# EAGLE design pc_ads1293_brk (EAGLE 9.5.2)
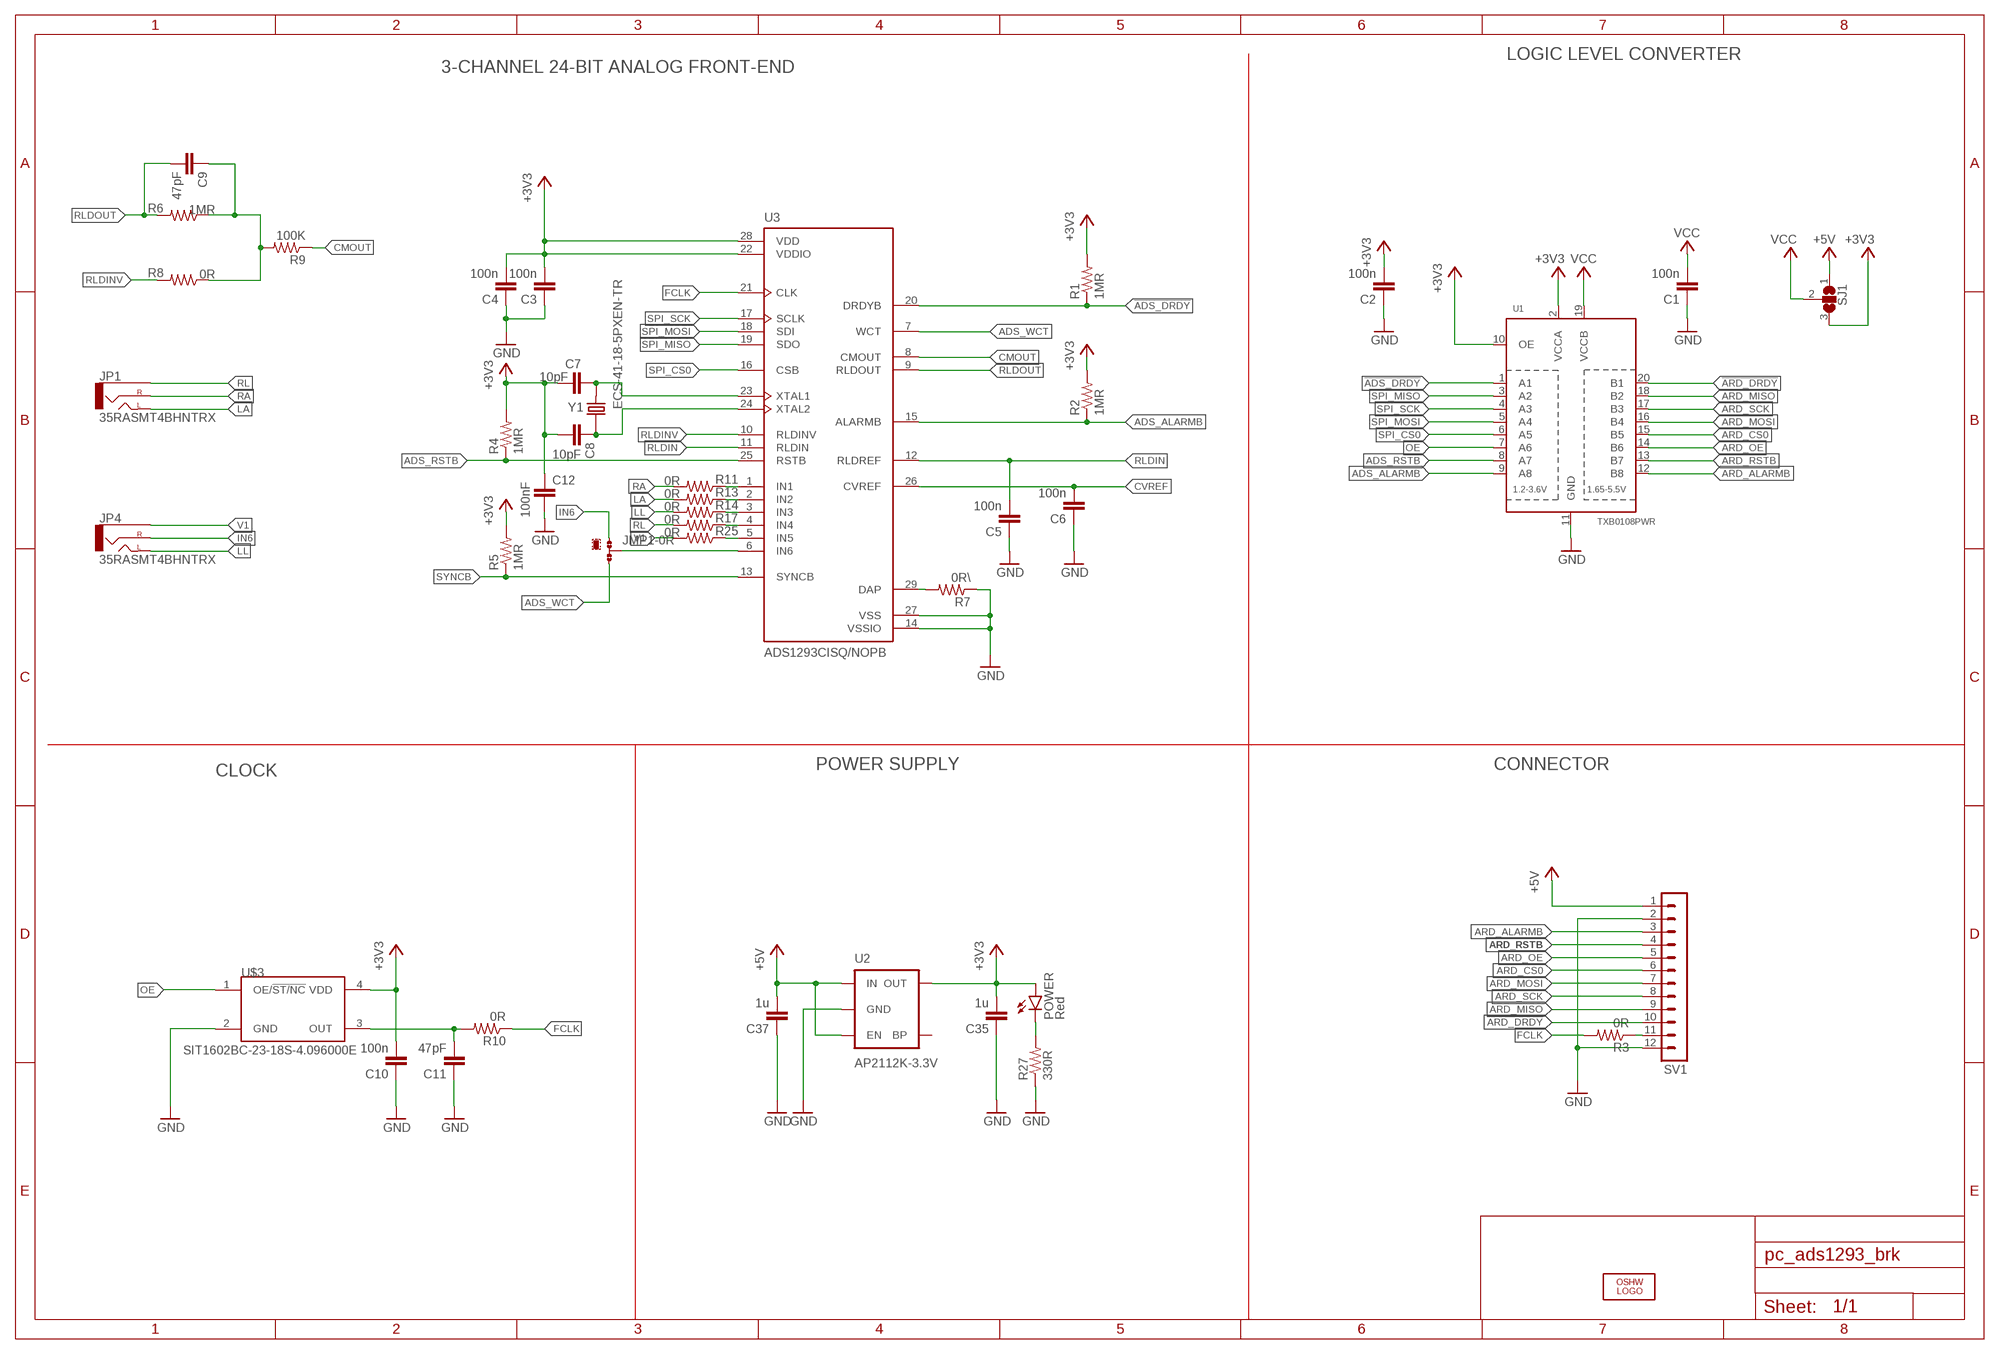
[diagram p0: schematic, sheet 1]

## Parts
C1  100n  C-EUC0402  [C0402]
C2  100n  C-EUC0402  [C0402]
C3  100n  C-EUC0402  [C0402]
C4  100n  C-EUC0402  [C0402]
C5  100n  C-EUC0402  [C0402]
C6  100n  C-EUC0402  [C0402]
C7  10pF  C-EUC0402  [C0402]
C8  10pF  C-EUC0402  [C0402]
C9  47pF  C-EUC0402  [C0402]
C10  100n  C-EUC0402  [C0402]
C11  47pF  C-EUC0402  [C0402]
C12  100nF  C-EUC0402  [C0402]
C35  1u  C-EUC0402  [C0402]
C37  1u  C-EUC0402  [C0402]
JMP1  0R-JUMPB  [B0R-JMP]
JP1  35RASMT4BHNTRX  AUDIO-JACKSMD2  [AUDIO-JACK-3.5MM-SMD]
JP4  35RASMT4BHNTRX  AUDIO-JACKSMD2  [AUDIO-JACK-3.5MM-SMD]
LOGO1  OSHW_LOGO_FILLX0100-NT  [OSHW_FILLX100_NOTEXT]
POWER  Red  LEDCHIPLED_0603  [CHIPLED_0603]
R1  1MR  R-US_R0402  [R0402]
R2  1MR  R-US_R0402  [R0402]
R3  0R  R-US_R0402  [R0402]
R4  1MR  R-US_R0402  [R0402]
R5  1MR  R-US_R0402  [R0402]
R6  1MR  R-US_R0402  [R0402]
R7  0R\  R-US_R0402  [R0402]
R8  0R  R-US_R0402  [R0402]
R9  100K  R-US_R0402  [R0402]
R10  0R  R-US_R0402  [R0402]
R11  0R  R-US_R0402  [R0402]
R13  0R  R-US_R0402  [R0402]
R14  0R  R-US_R0402  [R0402]
R17  0R  R-US_R0402  [R0402]
R25  0R  R-US_R0402  [R0402]
R27  330R  R-US_R0402  [R0402]
SJ1  SJ2W  [SJ_2]
SV1  MA12-1  [MA12-1]
U1  TXB0108PWR  [TSSOP20]
U2  AP2112K-3.3V  V_REG_LDOSMD  [SOT23-5]
U3  ADS1293CISQ/NOPB  [QFN50P500X500X80-29N]
U$3  SIT1602BC-23-18S-4.096000E  [SIT1602B]
Y1  ECS-41-18-5PXEN-TR  [XTAL_ECS-41-18-5PXEN-TR]

## Nets
!ADS_DRDY: R1.1 U1.1(A1) U3.20(DRDYB)
!ARD_DRDY: SV1.10 U1.20(B1)
+3V3: C2.2 C3.2 C4.2 C7.2 C8.2 C10.2 C12.1 C35.2 POWER.A R1.2 R2.2 R4.2 R5.2 SJ1.3 U1.2(VCCA) U1.10(OE) U2.5(OUT) U3.22(VDDIO) U3.28(VDD) U$3.4(VDD)
+5V: C37.2 SJ1.1 SV1.1 U2.1(IN) U2.3(EN)
ADS_ALARMB: R2.1 U1.9(A8) U3.15(ALARMB)
ADS_RSTB: R4.1 U1.8(A7) U3.25(RSTB)
ADS_WCT: JMP1.3 U3.7(WCT)
ARD_ALARMB: SV1.3 U1.12(B8)
ARD_CS0: SV1.6 U1.15(B5)
ARD_MISO: SV1.9 U1.18(B2)
ARD_MOSI: SV1.7 U1.16(B4)
ARD_OE: SV1.5 U1.14(B6)
ARD_RSTB: SV1.4 U1.13(B7)
ARD_SCK: SV1.8 U1.17(B3)
CLK: C11.2 R10.2 U$3.3(OUT)
CMOUT: R9.1 U3.8(CMOUT)
CVREF: C6.2 U3.26(CVREF)
FCLK: R3.2 R10.1 U3.21(CLK)
GND: C1.1 C2.1 C3.1 C4.1 C5.1 C6.1 C10.1 C11.1 C12.2 C35.1 C37.1 R7.1 R27.1 SV1.2 SV1.12 U1.11(GND) U2.2(GND) U3.14(VSSIO) U3.27(VSS) U$3.2(GND)
IN6: JMP1.1 JP4.RING(RIGHT)
LA: JP1.TIP(LEFT) R13.2
LL: JP4.TIP(LEFT) R14.2
N$1: C9.1 R6.1 R8.1 R9.2
N$2: R11.1 U3.1(IN1)
N$3: JMP1.2 U3.6(IN6)
N$4: C8.1 U3.24(XTAL2) Y1.1
N$5: C7.1 U3.23(XTAL1) Y1.2
N$6: R13.1 U3.2(IN2)
N$7: POWER.C R27.2
N$8: R7.2 U3.29(DAP)
N$9: R14.1 U3.3(IN3)
N$10: R3.1 SV1.11
N$13: R17.1 U3.4(IN4)
N$15: R25.1 U3.5(IN5)
OE: U1.7(A6) U$3.1(OE/!ST/NC)
RA: JP1.RING(RIGHT) R11.2
RL: JP1.SLEEVE R17.2
RLDIN: C5.2 U3.11(RLDIN) U3.12(RLDREF)
RLDINV: R8.2 U3.10(RLDINV)
RLDOUT: C9.2 R6.2 U3.9(RLDOUT)
SPI_CS0: U1.6(A5) U3.16(CSB)
SPI_MISO: U1.3(A2) U3.19(SDO)
SPI_MOSI: U1.5(A4) U3.18(SDI)
SPI_SCK: U1.4(A3) U3.17(SCLK)
SYNCB: R5.1 U3.13(SYNCB)
V1: JP4.SLEEVE R25.2
VCC: C1.2 SJ1.2 U1.19(VCCB)
Unconnected: U2.4(BP)

## Notes on the sheet
- LOGIC LEVEL CONVERTER
- 3-CHANNEL 24-BIT ANALOG FRONT-END
- POWER SUPPLY | CONNECTOR
- CLOCK

## Library data of the parts
C1-C12 C35 C37 = rcl:C-EU: CAPACITOR, European symbol; SPICEPREFIX: C
JMP1 = jump-0r-smd:0R-JUMP: SMD 0R 0805 Jumper
JP1 JP4 = SparkFun-Connectors:AUDIO-JACK: 3.5mm Audio Jack Simple 3.5mm common PCB mount audio jack. SKU: PRT-08032; PROD_ID: CONN-10353
LOGO1 = ohw-logo:OSHW_LOGO_FILL
POWER = led:LED: LED OSRAM: - CHIPLED LG R971, LG N971, LY N971, LG Q971, LY Q971, LO R971, LY R971 LH N974, LH R974 LS Q976, LO Q976, LY Q976 LO Q996 - Hyper CHIPLED LW Q18S LB Q993, LB Q99A, LB R99A - SideLED LS A670, LO A670, LY A670, LG A670, LP A670 LB A673, LV A673, LT A673, LW A673 LH A674 LY A675 LS A676, LA A676, LO A676, LY A676, LW A676 LS A679, LY A679, LG A679 - Hyper Micro SIDELED® LS Y876, LA Y876, LO Y876, LY Y876 LT Y87S - SmartLED LW L88C, LW L88S LB L89C, LB L89S, LG L890 LS L89K, LO L89K, LY L89K LS L896, LA L896, LO L896, LY L896 - TOPLED LS T670, LO T670, LY T670, LG T670, LP T670 LSG T670, LSP T670, LSY T670, LOP T670, LYG T670 LG T671, LOG T671, LSG T671 LB T673, LV T673, LT T673, LW T673 LH T674 LS T676, LA T676, LO T676, LY T676, LB T676, LH T676, LSB T676, LW T676 LB T67C, LV T67C, LT T67C, LS T67K, LO T67K, LY T67K, LW E67C LS E67B, LA E67B, LO E67B, LY E67B, LB E67C, LV E67C, LT E67C LW T67C LS T679, LY T679, LG T679 LS T770, LO T770, LY T770, LG T770, LP T770 LB T773, LV T773, LT T773, LW T773 LH T774 LS E675, LA E675, LY E675, LS T675 LS T776, LA T776, LO T776, LY T776, LB T776 LHGB T686 LT T68C, LB T68C - Hyper Mini TOPLED® LB M676 - Mini TOPLED Santana® LG M470 LS M47K, LO M47K, LY M47K Source: http://www.osram.convergy.de LUXEON: - LUMILED® LXK2-PW12-R00, LXK2-PW12-S00, LXK2-PW14-U00, LXK2-PW14-V00 LXK2-PM12-R00, LXK2-PM12-S00, LXK2-PM14-U00 LXK2-PE12-Q00, LXK2-PE12-R00, LXK2-PE12-S00, LXK2-PE14-T00, LXK2-PE14-U00 LXK2-PB12-K00, LXK2-PB12-L00, LXK2-PB12-M00, LXK2-PB14-N00, LXK2-PB14-P00, LXK2-PB14-Q00 LXK2-PR12-L00, LXK2-PR12-M00, LXK2-PR14-Q00, LXK2-PR14-R00 LXK2-PD12-Q00, LXK2-PD12-R00, LXK2-PD12-S00 LXK2-PH12-R00, LXK2-PH12-S00 LXK2-PL12-P00, LXK2-PL12-Q00, LXK2-PL12-R00 Source: www.luxeon.com KINGBRIGHT: KA-3528ASYC Source: www.kingbright.com
R1-R11 R13 R14 R17 R25 R27 = rcl:R-US_: RESISTOR, American symbol; SPICEPREFIX: R
SJ1 = jumper:SJ2W: SMD solder JUMPER
SV1 = con-lstb:MA12-1: PIN HEADER; OC_FARNELL: unknown; OC_NEWARK: unknown
U1 = adafruit:TXB0108PWR: 8-Bit Bi-Directional Level Shifter 1.2V-3.6V (VCCA) to 1.65V-5.5V (VCCB) bi-directional level shifter with auto direction sensing. Max data rate - VCCA 1.8V: 20Mbps (50ns), VCCA 3.3V: 100Mbps (10ns) Digikey: 296-21527-1-ND
U2 = SparkFun-PowerIC:V_REG_LDO: Voltage Regulator LDO Standard 150mA LDO voltage regulator in SOT-23 layout. Micrel part MIC5205. BP (by-pass) pin is used to lower output noise with 470pF cap.; PROD_ID: VREG-12457
U3 = ADS1293CISQ_NOPB:ADS1293CISQ/NOPB: Check prices <https://pricing.snapeda.com/search/part/ADS1293CISQ/NOPB/?ref=eda>; AVAILABILITY: Warning; DESCRIPTION: 24-bit, 3-ch, Low-Power Analog Front END (AFE) for ECG Applications 28-WQFN -20 to 85; MF: Texas Instruments; MP: ADS1293CISQ/NOPB; PACKAGE: WQFN-28 Texas Instruments; PRICE: None; PURCHASE-URL: https://pricing.snapeda.com/search/part/ADS1293CISQ/NOPB/?ref=eda
U$3 = circuitects:SIT1602BC-23-18S-4.096000E
Y1 = ECS-41-18-5PXEN-TR:ECS-41-18-5PXEN-TR: CRYSTAL SMD Check prices <https://pricing.snapeda.com/search/part/ECS-41-18-5PXEN-TR/?ref=eda>; AVAILABILITY: Warning; DESCRIPTION: 4.096MHz ±30ppm Crystal 18pF 150 Ohms HC-49/US; MF: ECS Inc.; MP: ECS-41-18-5PXEN-TR; PACKAGE: HC49/US ECS International; PRICE: None; PURCHASE-URL: https://pricing.snapeda.com/search/part/ECS-41-18-5PXEN-TR/?ref=eda

## Board
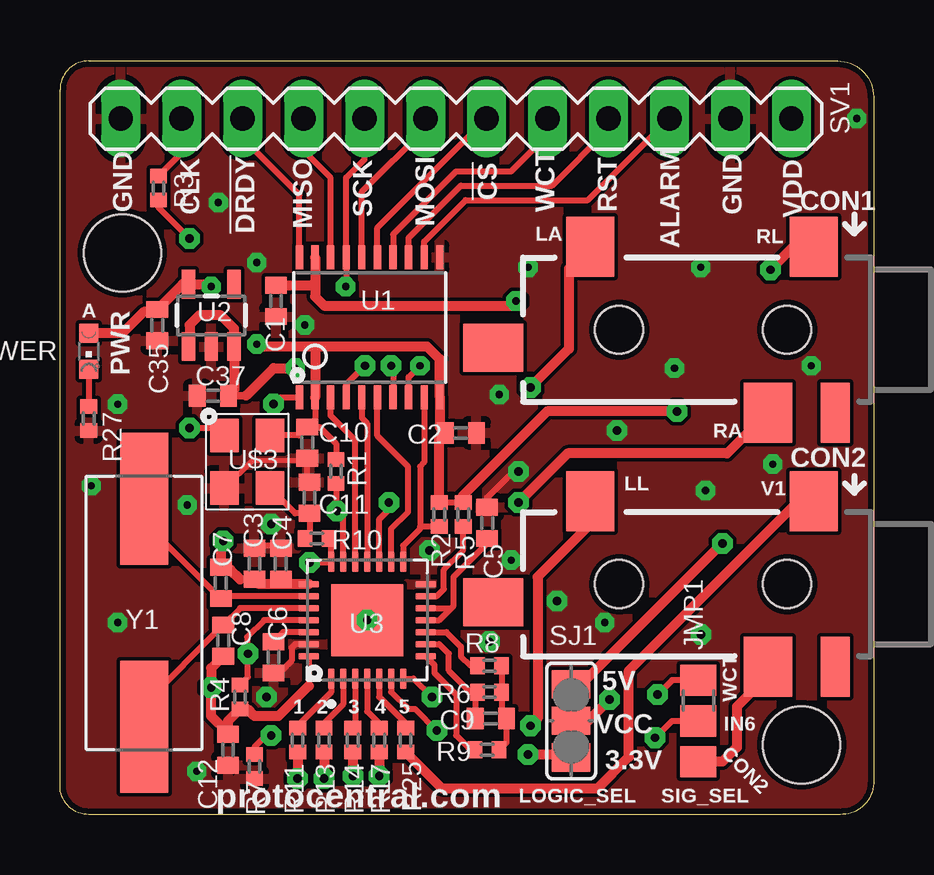
[diagram p1: board, top side]
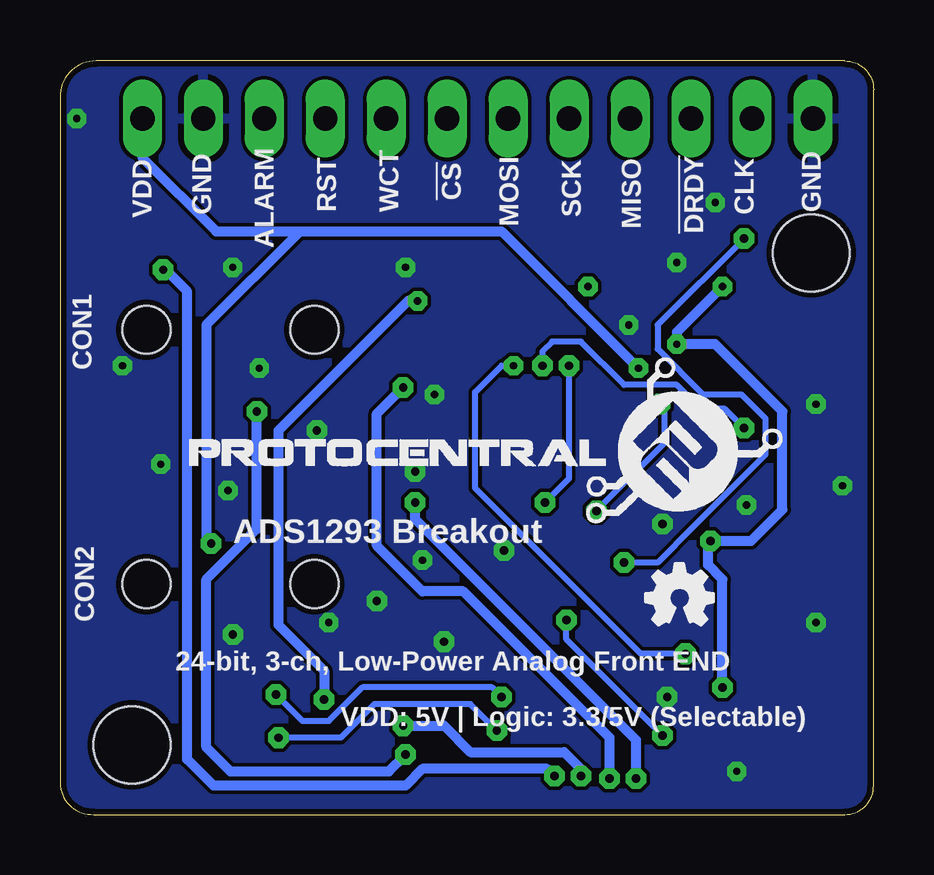
[diagram p2: board, bottom side, seen from below]

Size 33.9 x 31.4 mm. Coordinates in mm from the lower left corner, seen from the top.
Outline: 1.2,31.4 32.4,31.4 arc-90 33.9,29.9 33.9,1.3 arc-90 32.5,0 1.2,0 arc-90 0,1.2 0,30.2 arc-90 1.2,31.4
Copper layers (1*2*15*16): Top 0.035mm / dielectric 1.5mm / Route2 0.035mm / dielectric 0.15mm / Route15 0.035mm / dielectric 0.2mm / Bottom 0.035mm
Design rules "Circuitects-Rules": minimum track width 6mil, minimum drill 0.3mm, track to track 6mil, track to pad 6mil, pad to pad 6mil, via to via 6mil, smd to smd 6mil, copper to edge 10mil, drill to drill 8mil, minimum pad ring 12mil, minimum via ring 10mil, stop-mask expansion 4mil, vias tented up to drill 25mil, thermal gap 10mil
Holes 3.2 mm at 2.6,23.4 30.9,2.9

### Footprints (pad centres in the part's own frame; a part is rotated, then mirrored left to right if it is on the bottom)
C0402 = smd 0.7 x 0.9: 1 -0.65,0; 2 0.65,0
B0R-JMP = smd 1.5 x 1.3: 1 0,1.7; 2 0,0; 3 0,-1.7
AUDIO-JACK-3.5MM-SMD = smd 2 x 2.5: RING 4.3,3.45; SLEEVE 2.4,-3.45; TIP 11.7,-3.45 | smd 1.2 x 2.5: RSH 1.5,3.45 | smd 2.5 x 2: TSH 15.75,0.75 | hole 2: 3.5,0; 10.5,0
CHIPLED_0603 = smd 0.8 x 0.8: A 0,-0.75; C 0,0.75
R0402 = smd 0.6 x 0.7: 1 -0.5,0; 2 0.5,0
SJ_2 = smd 1.168 x 1.6: 1 -1.524,0; 2 0,0; 3 1.524,0
MA12-1 = drill 1.016 long: 1 -13.97,0; 2 -11.43,0; 3 -8.89,0; 4 -6.35,0; 5 -3.81,0; 6 -1.27,0; 7 1.27,0; 8 3.81,0; 9 6.35,0; 10 8.89,0; 11 11.43,0; 12 13.97,0
TSSOP20 = smd 0.305 x 0.991: 1 -2.925,-2.918; 2 -2.275,-2.918; 3 -1.625,-2.918; 4 -0.975,-2.918; 5 -0.325,-2.918; 6 0.325,-2.918; 7 0.975,-2.918; 8 1.625,-2.918; 9 2.275,-2.918; 10 2.925,-2.918; 11 2.925,2.918; 12 2.275,2.918; 13 1.625,2.918; 14 0.975,2.918; 15 0.325,2.918; 16 -0.325,2.918; 17 -0.975,2.918; 18 -1.625,2.918; 19 -2.275,2.918; 20 -2.925,2.918
SOT23-5 = smd 0.55 x 1.2: 1 -0.95,-1.3; 2 0,-1.3; 3 0.95,-1.3; 4 0.95,1.3; 5 -0.95,1.3
QFN50P500X500X80-29N = smd 0.86 x 0.27: 1 -2.435,1.5; 2 -2.435,1; 3 -2.435,0.5; 4 -2.435,0; 5 -2.435,-0.5; 6 -2.435,-1; 7 -2.435,-1.5; 15 2.435,-1.5; 16 2.435,-1; 17 2.435,-0.5; 18 2.435,0; 19 2.435,0.5; 20 2.435,1; 21 2.435,1.5 | smd 0.27 x 0.86: 8 -1.5,-2.435; 9 -1,-2.435; 10 -0.5,-2.435; 11 0,-2.435; 12 0.5,-2.435; 13 1,-2.435; 14 1.5,-2.435; 22 1.5,2.435; 23 1,2.435; 24 0.5,2.435; 25 0,2.435; 26 -0.5,2.435; 27 -1,2.435; 28 -1.5,2.435 | smd 3 x 3: 29 0,0
SIT1602B = smd 1.4 x 1.2: 1 -1.1,-0.95; 2 1.1,-0.95; 3 1.1,0.95; 4 -1.1,0.95
XTAL_ECS-41-18-5PXEN-TR = smd 5.5 x 2: 1 -4.75,0; 2 4.75,0

### Placement (x,y rotation side)
C1  9,21.4 90 top
C2  16.7,15.9 180 top
C3  8.1,10.45 270 top
C4  9.2,10.45 270 top
C5  17.8,12.15 270 top
C6  8.9,6.55 90 top
C7  6.7,9.65 90 top
C8  6.8,7.25 270 top
C9  17.95,4 180 top
C10  10.3,15.5 90 top
C11  10.4,13.2 270 top
C12  7,2.7 270 top
C35  4.05,20.39 90 top
C37  6.37,17.45 0 top
JMP1  26.6,3.9 180 top
JP1  33.8,20.2 180 top
JP4  33.8,9.6 180 top
LOGO1  9.5,7.9 0 bottom
POWER  1.2,19.3 180 top
R1  11.5,14.3 90 top
R2  15.8,12.5 90 top
R3  4.1,26.1 270 top
R4  7.5,4.9 270 top
R5  16.8,12.5 90 top
R6  17.9,5.1 180 top
R7  8.1,2 90 top
R8  17.9,6.2 180 top
R9  17.8,2.7 0 top
R10  10.7,11.5 180 top
R11  9.9,3.1 270 top
R13  11,3.1 270 top
R14  12.2,3.1 270 top
R17  13.3,3.1 270 top
R25  14.4,3.1 270 top
R27  1.2,16.5 90 top
SJ1  21.3,3.9 270 top
SV1  16.5,29 180 top
U1  12.9,20.3 0 top
U2  6.3,20.8 0 top
U3  12.8,8.1 90 top
U$2  [PROTY_WITH_TEXT]  28.5,12.5 0 bottom
U$3  7.8,14.7 270 top
Y1  3.5,8.4 90 top

### Tracks (layer width: path | path; a pad name or v marks a point on that pad's centre or on a via)
!ADS_DRDY  (via drill 0.35)
  Top 0.254: U3.20 11.8,12.4 v11.55,12.65 11.5,12.7 R1.1 | v8.9,17.1 9.18,17.38 U1.1
  Bottom 0.254: v11.55,12.65 8.7,15.5 8.7,16.9 v8.9,17.1
!ARD_DRDY
  Top 0.254: U1.20 9.97,25.82 7.61,28.18 SV1.10
+3V3  (via drill 0.3, 0.35)
  Top 0.254: C35.2 3.95,20.94 | U3.28 10.37,5.37 | 8.3,9.6 C3.2 7.5,9.8 | 7.1,10.2 6.8,10.2 C7.2 | R5.2 R2.2 | C10.2 10.8,16.15 11.5,15.45 R1.2 | C10.2 9.95,15.8 U$3.4 | C12.1 7,3.4 | U1.2 10.62,16.47 C10.2
  Top 0.305: 10.62,19.38 10.5,19.5
  Top 0.406: 3.95,20.94 3.49,20.94 2.6,20.05 POWER.A | 10.62,19.38 U1.2 | v8.2,19.6 8.3,19.5 10.5,19.5 15.3,19.5 15.83,18.97 U1.10 15.83,16.12 C2.2 15.8,15.65 R2.2 | v6.3,22 6.2,22.1 U2.5 5.11,22.1 C35.2 | 10.37,5.37 9.1,4.1 8.1,4.1 7.8,4.4 R4.2 7,3.9 7,3.4 6.3,4.1 v6.3,5.3 6.3,6.1 C8.2 | U3.22 9.2,9.6 | 9.2,9.6 8.3,9.6 | C4.2 9.2,9.6 | 7.5,9.8 7.1,10.2 | SJ1.3 21.22,2.38 21.1,2.5 v19.5,2.5 | v25.7,16.8 20.3,16.8 16.8,13.3 R5.2 | v6.8,11.4 6.7,11.3 C7.2
  Bottom 0.406: v19.5,2.5 20.2,1.8 26.8,1.8 27.8,2.8 27.8,9.8 25.7,11.9 v25.7,16.8 | v6.3,5.3 6.3,9.8 6.9,10.4 6.9,11.3 v6.8,11.4 5.1,11.4 3.8,12.7 3.8,16.8 6.6,19.6 v8.2,19.6 8.2,20.1 v6.3,22
+5V  (via drill 0.3, 0.35)
  Top 0.305: C37.2 7.75,17.45
  Top 0.406: U2.1 5.4,19.55 5.4,20.4 5.8,20.8 6.7,20.8 7.25,20.25 U2.3 7.25,17.68 C37.2 | v9.8,18.6 8.9,18.6 7.75,17.45 | SJ1.1 21.72,5.42 v27.6,11.3
  Bottom 0.406: SV1.1 30.47,27.37 27.4,24.3 23.9,24.3 | 23.9,24.3 15.5,24.3 v9.8,18.6 | v27.6,11.3 27.8,11.5 27.8,20.4 23.9,24.3
ADS_ALARMB
  Top 0.254: U3.15 14.3,11.2 15,11.9 15,12 | U1.9 15.18,14.68 15,14.5 15,12 | R2.1 15,12
ADS_RSTB  (via drill 0.3, 0.35)
  Top 0.254: U1.8 14.53,18.22 v15,18.7 | U3.25 8.5,8.1 7.8,7.4 7.8,6.73 v7.83,6.7 7.83,5.73 R4.1
  Bottom 0.254: v7.83,6.7 9.7,6.7 16.6,13.6 16.6,17.6 15.5,18.7 v15,18.7
ADS_WCT  (via drill 0.35)
  Top 0.254: U3.7 14.74,5.67 v15.5,4.9 | JMP1.3 25.5,5.6 v24.9,5
  Bottom 0.254: v24.9,5 23.8,3.9 22.7,3.9 21.3,5.3 15.9,5.3 v15.5,4.9
ARD_ALARMB
  Top 0.254: U1.12 15.18,23.88 16.9,25.6 21.99,25.6 SV1.3
ARD_CS0
  Top 0.254: U1.15 13.22,24.45 SV1.6
ARD_MISO
  Top 0.254: U1.18 11.28,26.52 10.15,27.65 SV1.9
ARD_MOSI
  Top 0.254: U1.16 12.58,25.95 15.23,28.6 SV1.7
ARD_OE
  Top 0.254: SV1.5 20.31,28.31 18.8,26.8 16.5,26.8 13.88,24.17 U1.14
ARD_RSTB
  Top 0.254: U1.13 14.53,24.02 16.7,26.2 20.5,26.2 22.85,28.55 SV1.4
ARD_SCK  (via drill 0.3)
  Top 0.254: v11.9,22 11.93,22.02 U1.17 11.93,26.54 12.69,27.3 SV1.8
CLK
  Top 0.254: R10.2 10.4,11.7 C11.2 9.8,12.55 U$3.3
CMOUT
  Top 0.254: R9.1 17.3,2.8 17,2.8 16.5,3.3 16.5,5 15.6,5.9 15.6,6.24 U3.8
CVREF
  Top 0.254: U3.26 9.3,7.6 C6.2
FCLK  (via drill 0.35)
  Top 0.254: v10.4,10.5 11.27,10.5 U3.21 11.3,11.4 R10.1 | R3.2 4.1,25.3 v5.4,24
  Bottom 0.254: v5.4,24 9,20.4 9,19.4 7.1,17.5 5.5,17.5 4.5,16.5 4.5,15 7.51,11.99 9,10.5 v10.4,10.5
GND  (via drill 0.3, 0.35)
  Top 0.2: C10.1 10.2,14.75 8,14.75 U$3.2
  Top 0.254: U3.27 9.8,7.1 9.66,6.96 9.66,6.4 9.16,5.9 C6.1 | C4.1 9.1,11.2 8.2,11.2 C3.1 | C11.1 10.3,13.95 C10.1 | C5.1 17.8,13.2 18.9,14.3 v19.1,14.3
  other vias: 18.3,17.5 1.3,13.7 29.7,14.6 31.3,18.7 26.7,22.8 2.4,8 2.4,17.1 6.6,25.5 8.2,23 5.7,1.8 22.7,8 5.3,12.9 26.9,13.5 19.5,22.8 33.2,29 18.8,10.6 10.2,20.4 25.6,18.6 8.6,4.9 15.4,11 23.2,16 8.8,12.1 17.9,7.2 20.7,8.9 26.7,7.5
  pour Top: -0.1,31.4 33.9,31.4 33.9,-0.1 -0.1,-0.1
  pour Bottom: -0.1,31.4 33.9,31.4 33.9,-0.1 -0.1,-0.1
IN6
  Top 0.406: JP4.RING 29.5,5.8 28.2,4.5 28.2,2.8 27.6,2.2 JMP1.1
LA  (via drill 0.35)
  Top 0.254: JP1.TIP 21.2,22.75
  Top 0.406: R13.2 v11,1.5 | v19.6,17.8 21.2,19.4 21.2,22.75
  Bottom 0.406: v11,1.5 11,3.2 17.1,9.3 18.8,9.3 20.7,11.2 20.7,16.7 v19.6,17.8
LL  (via drill 0.35)
  Top 0.254: JP4.TIP 22.1,12.1
  Top 0.406: R14.2 v12.2,1.6 | 22.1,12.1 19.9,9.9 19.9,4 v19.6,3.7
  Bottom 0.406: v19.6,3.7 17.9,3.7 16.8,2.6 12.9,2.6 12.2,1.9 v12.2,1.6
N$1
  Top 0.254: R8.1 R6.1 18.4,4.2 C9.1 18.6,3 R9.2
N$2
  Top 0.254: U3.1 11.3,5.1 9.9,3.7 R11.1
N$3  (via drill 0.35)
  Top 0.254: U3.6 13.8,5.1 14.5,4.4 14.8,4.4 v15.7,3.5 | v24.8,3.2 25.5,3.9 JMP1.2
  Bottom 0.254: v15.7,3.5 16.8,4.6 20.8,4.6 22.2,3.2 v24.8,3.2
N$4
  Top 0.254: U3.24 7.5,8.6 C8.1 3.5,4.6 Y1.1
N$5
  Top 0.254: U3.23 6.8,9.1 C7.1 3.6,12.1 3.6,13.05 Y1.2
N$6
  Top 0.254: U3.2 11.8,4.6 11,3.8 R13.1
N$7
  Top 0.254: POWER.C R27.2
N$8  (via drill 0.35)
  Top 0.254: R7.2 8.1,2.8 8.6,3.3 v8.8,3.3
  Bottom 0.254: U3.29 12.8,7.3 v8.8,3.3
  other vias: 12.8,8.1
N$9
  Top 0.254: U3.3 12.3,3.7 R14.1
N$10
  Top 0.254: SV1.11 5.07,27.57 R3.1
N$13
  Top 0.254: U3.4 12.8,4.3 13.3,3.8 R17.1
N$15
  Top 0.254: U3.5 13.3,4.9 14.4,3.8 R25.1
OE  (via drill 0.35)
  Top 0.254: U$3.1 6.55,16.1 v5.4,16.1 | v13.8,18.7 13.88,18.62 U1.7
  Bottom 0.254: v5.4,16.1 6.2,16.9 7.2,16.9 8.2,17.9 10.4,17.9 12.2,19.7 13.4,19.7 13.8,19.3 v13.8,18.7
RA  (via drill 0.35)
  Top 0.406: R11.2 v9.9,1.5 | JP1.RING 27.8,15.05 21.15,15.05 v19.1,13
  Bottom 0.406: v9.9,1.5 9.9,3.1 19.1,12.3 v19.1,13
RL  (via drill 0.35)
  Top 0.406: R17.2 v13.3,1.6 | v29.6,22.7 30.55,23.65 JP1.SLEEVE
  Bottom 0.406: v29.6,22.7 29.5,22.7 28.6,21.8 28.6,2.3 27.5,1.2 19.5,1.2 18.8,1.9 13.6,1.9 v13.3,1.6
RLDIN
  Top 0.254: U3.12 16.3,8.6 | 16.3,8.6 16.4,8.7 16.4,9.9 17.8,11.3 C5.2 | U3.11 15.8,8.1 16.3,8.6
RLDINV
  Top 0.254: U3.10 16.1,7.6 16.71,6.99 16.71,6.6 17.11,6.2 R8.2
RLDOUT
  Top 0.254: U3.9 15.8,7.1 16.2,6.7 16.2,6 17.1,5.1 R6.2 17.3,5 C9.2
SPI_CS0
  Top 0.254: U3.16 13.8,11.9 14.5,12.6 14.5,14.5 13.22,15.78 U1.6
SPI_MISO
  Top 0.254: U1.3 11.28,16.62 12.3,15.6 U3.19
SPI_MOSI
  Top 0.254: U1.5 12.58,16.52 12.8,16.3 U3.18
SPI_SCK  (via drill 0.35)
  Top 0.254: U3.17 13.3,12.3 13.7,12.7 v13.7,13 | v12.7,18.7 11.93,17.92 U1.4
  Bottom 0.254: v12.7,18.7 12.7,14 v13.7,13
SYNCB
  Top 0.254: U3.13 15.7,9.1 15.99,9.39 15.99,10.19 16.8,11 R5.1
V1
  Top 0.254: 30.75,13.05 JP4.SLEEVE
  Top 0.406: 30.75,13.05 23.7,6 23.7,2.4 22.4,1.1 15.9,1.1 R25.2
VCC  (via drill 0.3, 0.35)
  Top 0.305: 10.47,22.05 10.62,22.2
  Top 0.406: U1.19 10.62,22.2 10.62,21.57 11,21.2 19,21.2 v19,21.4 | C1.2 10.47,22.05 | v22.9,4.8 22,3.9 SJ1.2
  Bottom 0.406: v19,21.4 19.4,21.4 24.8,16 24.8,7.9 22.9,6 v22.9,4.8

### Text on the board
tPlace: VDD | !CS | CON1 | GND | CLK | SCK | MOSI | WCT | RST | GND | !DRDY | MISO | LA | ALARM | RL | A | PWR | RA | CON2 | LL | V1 | 5V | WCT | 1 | 2 | 3 | 4 | 5 | VCC | IN6 | 3.3V | CON2 | protocentral.com | LOGIC_SEL | SIG_SEL
bPlace: VDD | !CS | GND | CLK | SCK | MOSI | WCT | RST | GND | !DRDY | MISO | ALARM | CON1 | ADS1293 Breakout | CON2 | 24-bit, 3-ch, Low-Power Analog Front END | VDD: 5V | Logic: 3.3/5V (Selectable)